# EAGLE design FD Capacitance Sensor v15 (EAGLE 9.5.2)
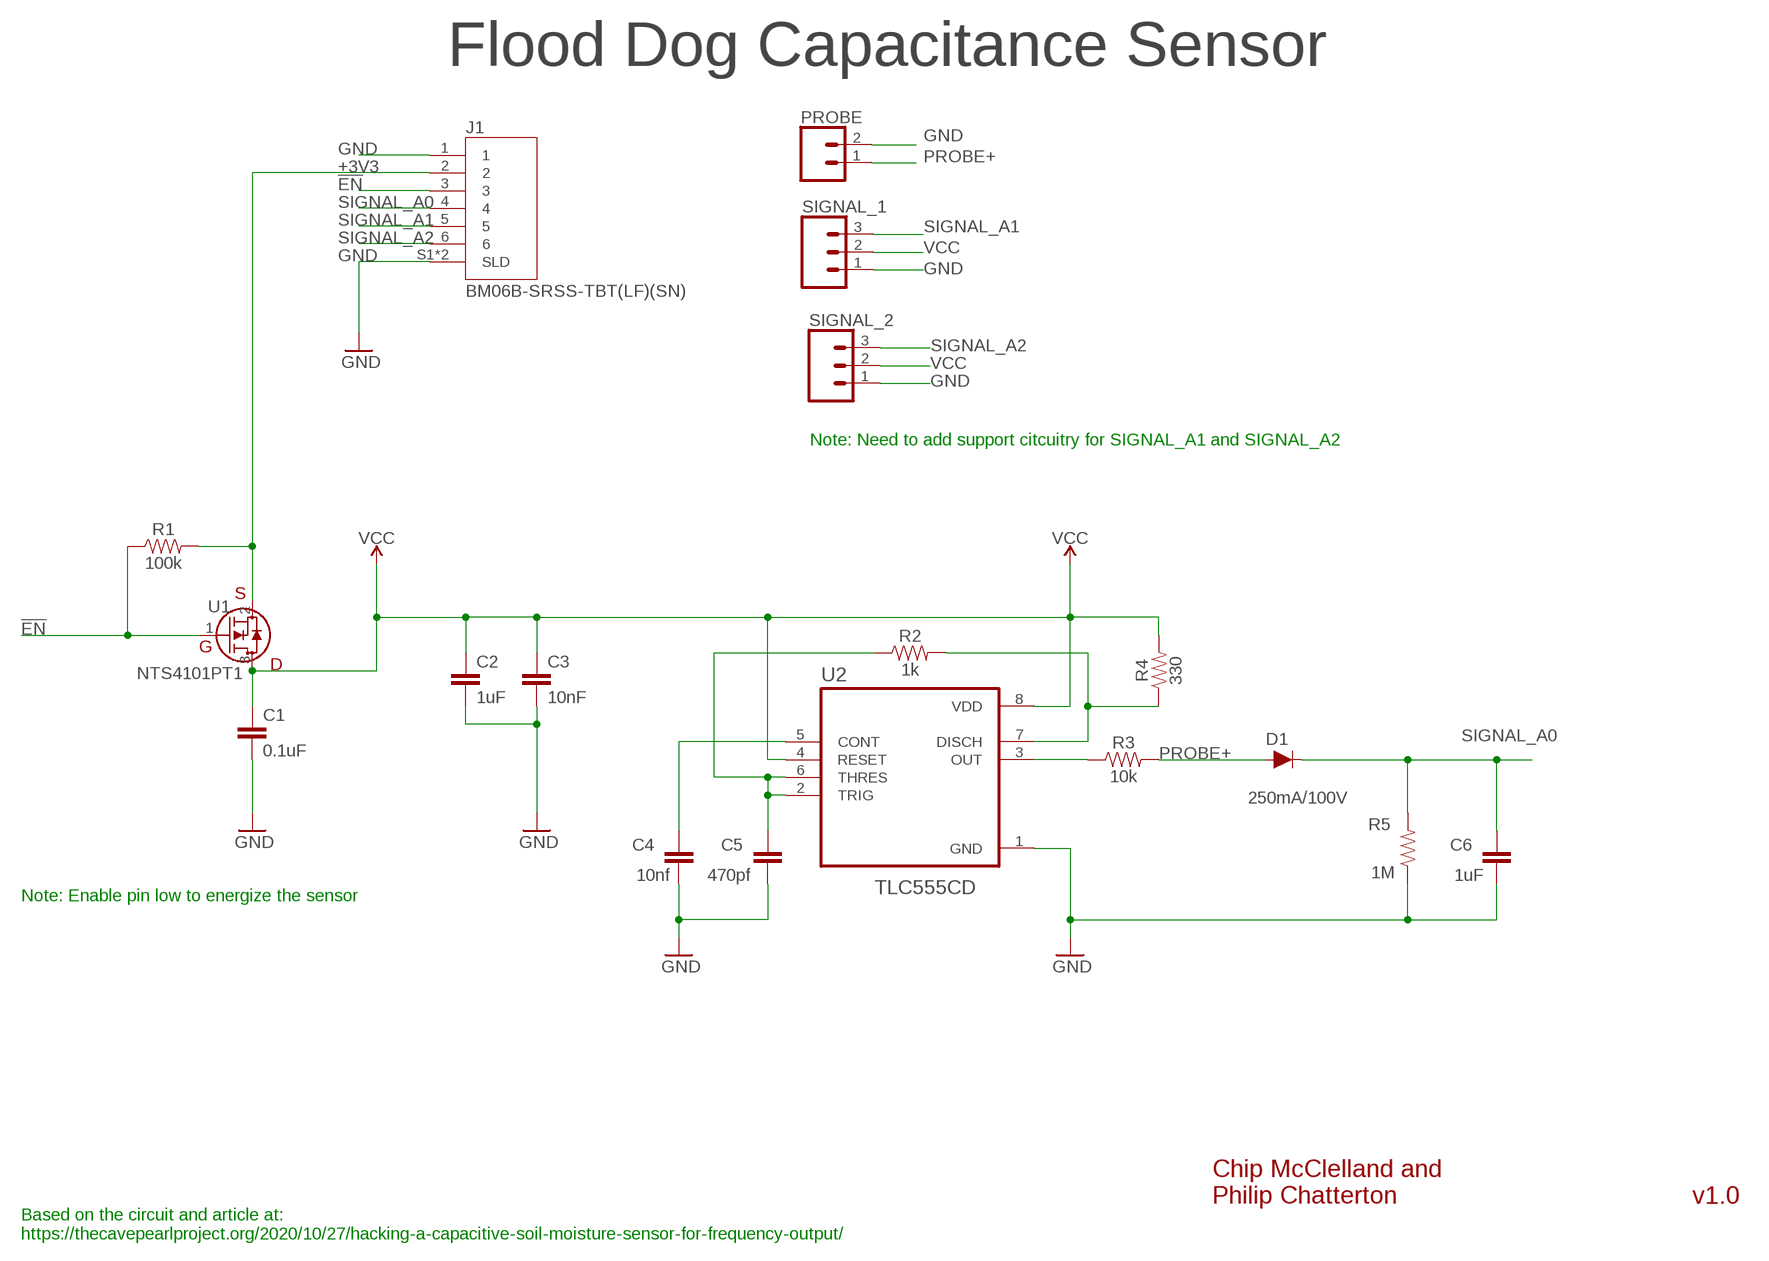
[diagram p0: schematic, sheet 1]

## Parts
C1  0.1uF  CAP-MF-0.1UF-0805  [0805@1]
C2  1uF  CAP-MF-1UF-0805  [0805@1]
C3  10nF  CAP-10NF-0805  [0805@1]
C4  10nf  C-EUC0805  [C0805]
C5  470pf  C-EUC0805  [C0805]
C6  1uF  C-EUC0805  [C0805]
D1  250mA/100V  DIODE-BAS16J  [SOD-323]
J1  BM06B-SRSS-TBT(LF)(SN)  [JST_BM06B-SRSS-TB(LF)(SN)]
PROBE  CONN_02  [1X02]
R1  100k  RESISTOR-MF-100K-0805  [0805]
R2  1k  RESISTOR-MF-1K-0805  [0805]
R3  10k  RESISTOR-MF-10K-0805  [0805]
R4  330  RESISTOR-MF-330-0805  [0805]
R5  1M  RESISTOR-MF-1K-0805  [0805]
SIGNAL_1  CONN_03  [1X03]
SIGNAL_2  CONN_03  [1X03]
U1  NTS4101PT1  [SOT_101PT1_ONS]
U2  TLC555CD  [SOIC127P599X175-8N]

## Nets
!EN: J1.3 R1.1 U1.1(G)
+3V3: J1.2 R1.2 U1.2(S)
GND: C1.2 C2.2 C3.2 C4.1 C5.1 C6.1 J1.1 J1.S1(SLD) J1.S2(SLD) PROBE.2 R5.1 SIGNAL_1.1 SIGNAL_2.1 U2.1(GND)
N$1: C4.2 U2.5(CONT)
N$5: R3.1 U2.3(OUT)
N$8: C5.2 R2.1 U2.2(TRIG) U2.6(THRES)
N$9: R2.2 R4.1 U2.7(DISCH)
PROBE+: D1.A PROBE.1 R3.2
SIGNAL_A0: C6.2 D1.C J1.4 R5.2
SIGNAL_A1: J1.5 SIGNAL_1.3
SIGNAL_A2: J1.6 SIGNAL_2.3
VCC [VCC]: C1.1 C2.1 C3.1 R4.2 SIGNAL_1.2 SIGNAL_2.2 U1.3(D) U2.4(RESET) U2.8(VDD)

## Notes on the sheet
- Flood Dog Capacitance Sensor
- Note: Need to add support citcuitry for SIGNAL_A1 and SIGNAL_A2
- Note: Enable pin low to energize the sensor
- Chip McClelland and
  Philip Chatterton
- v1.0
- Based on the circuit and article at:
  https://thecavepearlproject.org/2020/10/27/hacking-a-capacitive-soil-moisture-sensor-for-frequency-output/

## Library data of the parts
C1 = Custom Components:CAP-MF-0.1UF-: Capacitor Macrofab House Part (https://factory.macrofab.com/parts). Standard ceramic capacitor, and 0.1" leaded capacitor.; HOUSEPART: YES; MPN: MF-CAP-0805-0.1uF; POPULATE: 1; URL: https://factory.macrofab.com/part/MF-CAP-0805-0.1uF
C2 = Custom Components:CAP-MF-1UF-: Capacitor Macrofab House Part (https://factory.macrofab.com/parts). Standard ceramic capacitor, and 0.1" leaded capacitor.; HOUSEPART: yes; MPN: MF-CAP-0805-1uF; POPULATE: 1; URL: https://factory.macrofab.com/part/MF-CAP-0805-1uF
C3 = Custom Components:CAP-10NF-: Capacitor 10nF variant Standard 0805 ceramic capacitor; DIGIKEY: 399-C0805X103K1RAC3316CT-ND; HOUSEPART: NO; MPN: C0805X103K1RAC3316; POPULATE: 1; URL: https://www.digikey.com/en/products/detail/kemet/C0805X103K1RAC3316/10315780
C4-C6 = rcl:C-EU: CAPACITOR, European symbol; SPICEPREFIX: C
D1 = Custom Components:DIODE: Diode These are standard reverse protection diodes and small signal diodes. SparkFun Products: SparkFun SparkPunk Sound Kit <https://www.sparkfun.com/products/11177> SparkFun ESP8266 Thing <https://www.sparkfun.com/products/13231>; MPN: BAS16HT1G
J1 = Custom Components:BM06B-SRSS-TBT(LF)(SN): 6 Position 1.0mm Top-Entry Surface Mount Shrouded Header; MPN: BM06B-SRSS-TBT(LF)(SN); POPULATE: 1
PROBE = SparkFun-Connectors:CONN_02: Multi connection point. Often used as Generic Header-pin footprint for 0.1 inch spaced/style header connections On any of the 0.1 inch spaced packages, you can populate with these: Break Away Headers - Straight <https://www.sparkfun.com/products/116> (PRT-00116) Break Away Male Headers - Right Angle <https://www.sparkfun.com/products/553> (PRT-00553) Female Headers <https://www.sparkfun.com/products/115> (PRT-00115) Break Away Headers - Machine Pin <https://www.sparkfun.com/products/117> (PRT-00117) Break Away Female Headers - Swiss Machine Pin <https://www.sparkfun.com/products/743> (PRT-00743) For SCREWTERMINALS and SPRING TERMINALS visit here: Screw Terimnals on SparkFun.com <https://www.sparkfun.com/search/results?term=Screw+Terminals> (5mm/3.5mm/2.54mm spacing) This device is also useful as a general connection point to wire up your design to another part of your project. Our various solder wires solder well into these plated through hole pads. Hook-Up Wire - Assortment (Stranded, 22 AWG) <https://www.sparkfun.com/products/11375> (PRT-11375) Hook-Up Wire - Assortment (Solid Core, 22 AWG) <https://www.sparkfun.com/products/11367> (PRT-11367) View the entire wire category on our website here <https://www.sparkfun.com/categories/141> Special notes: Molex polarized connector foot print use with: PRT-08233 with associated crimp pins and housings. 2.54_SCREWTERM for use with PRT-10571. 3.5mm Screw Terminal footprints for PRT-08084 5mm Screw Terminal footprints for use with PRT-08432
R1 = Custom Components:RESISTOR-MF-100K-: Generic 0805 Resistor Package; MPN: MF-RES-0805-100K; POPULATE: 1; URL: https://factory.macrofab.com/part/MF-RES-0805-100K
R2 = Custom Components:RESISTOR-MF-1K-: Generic 0805 Resistor Package; HOUSEPART: YES; MPN: MF-RES-0805-1K; POPULATE: 1; URL: https://factory.macrofab.com/part/MF-RES-0805-1k
R3 = Custom Components:RESISTOR-MF-10K-: Generic 0805 Resistor Package; MPN: MF-RES-0805-10K; POPULATE: 1; URL: https://factory.macrofab.com/part/MF-RES-0805-10K
R4 = Custom Components:RESISTOR-MF-330-: Generic 0805 Resistor Package; HOUSEPART: YES; MPN: MF-RES-0805-330; POPULATE: 1
R5 = Custom Components:RESISTOR-MF-1K-: Generic 0805 Resistor Package; HOUSEPART: YES; MPN: MF-RES-0805-1K; POPULATE: 1; URL: https://factory.macrofab.com/part/MF-RES-0805-1k; VALUE: 1k
SIGNAL_1 SIGNAL_2 = SparkFun-Connectors:CONN_03: Multi connection point. Often used as Generic Header-pin footprint for 0.1 inch spaced/style header connections On any of the 0.1 inch spaced packages, you can populate with these: Break Away Headers - Straight <https://www.sparkfun.com/products/116> (PRT-00116) Break Away Male Headers - Right Angle <https://www.sparkfun.com/products/553> (PRT-00553) Female Headers <https://www.sparkfun.com/products/115> (PRT-00115) Break Away Headers - Machine Pin <https://www.sparkfun.com/products/117> (PRT-00117) Break Away Female Headers - Swiss Machine Pin <https://www.sparkfun.com/products/743> (PRT-00743) Stackable Header - 3 Pin (Female, 0.1") <https://www.sparkfun.com/products/13875> (PRT-13875) For SCREWTERMINALS and SPRING TERMINALS visit here: Screw Terimnals on SparkFun.com <https://www.sparkfun.com/search/results?term=Screw+Terminals> (5mm/3.5mm/2.54mm spacing) This device is also useful as a general connection point to wire up your design to another part of your project. Our various solder wires solder well into these plated through hole pads. Hook-Up Wire - Assortment (Stranded, 22 AWG) <https://www.sparkfun.com/products/11375> (PRT-11375) Hook-Up Wire - Assortment (Solid Core, 22 AWG) <https://www.sparkfun.com/products/11367> (PRT-11367) View the entire wire category on our website here <https://www.sparkfun.com/categories/141> Special notes: Molex polarized connector foot print use with SKU : PRT-08232 with associated crimp pins and housings.
U1 = Custom Components:NTS4101PT1; DATASHEET: https://datasheet.octopart.com/NTS4101PT1-ON-Semiconductor-datasheet-139013286.pdf; MANUFACTURER_PART_NUMBER: NTS4101PT1; SOURCELIBRARY: ON_Semiconductor_2020-03-06; VENDOR: ON Semiconductor
U2 = Custom Components:TLC555CD; DESCRIPTION: 2.1-MHz, 250-A, Low-Power Timer 8-SOIC 0 to 70; DIGI-KEY_PART_NUMBER: 296-52992-ND; MF: Texas Instruments; MP: TLC555CD; PACKAGE: SOIC-8 Texas Instruments; PURCHASE-URL: https://pricing.snapeda.com/search/part/TLC555CD/?ref=eda

## Board
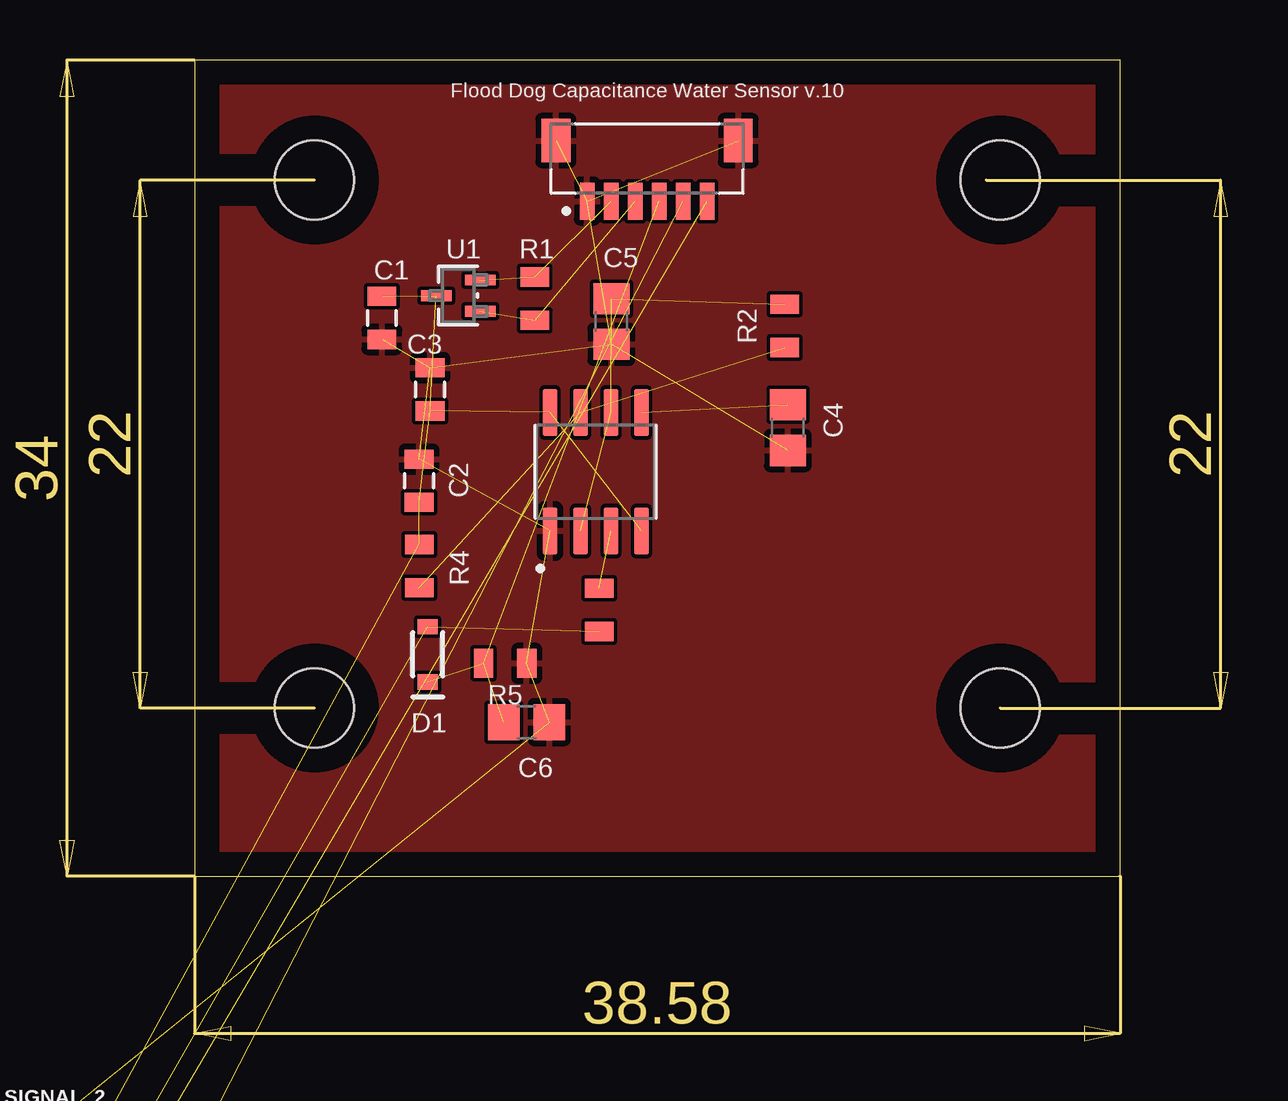
[diagram p1: board, top side]
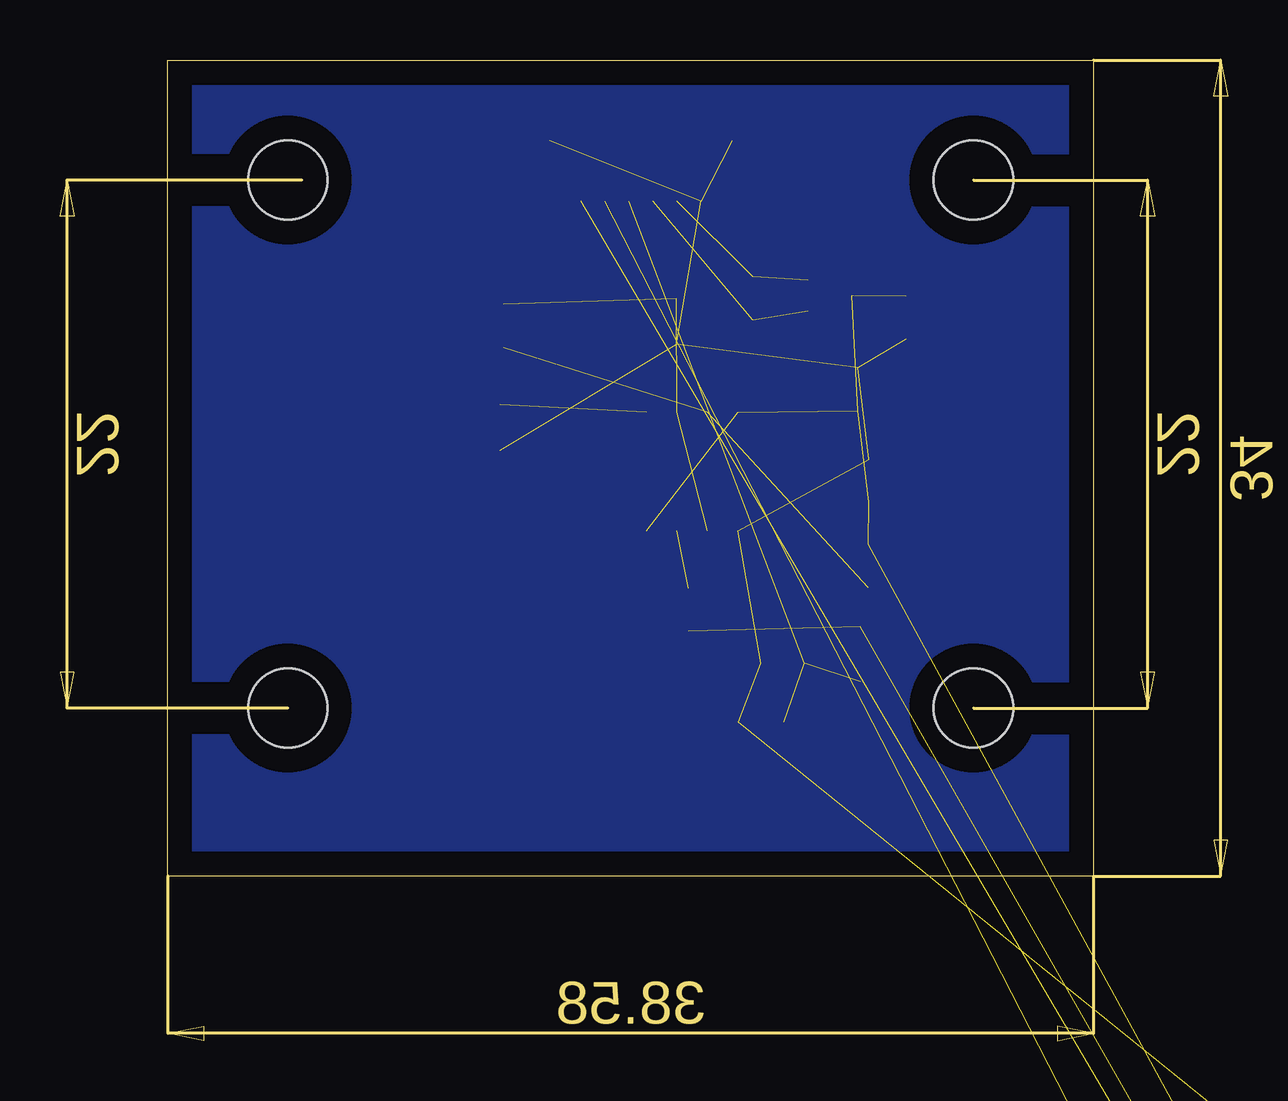
[diagram p2: board, bottom side, seen from below]

Size 38.58 x 34 mm. Coordinates in mm from the lower left corner, seen from the top.
Outline: 0,0 38.58,0 38.58,34 0,34 0,0
Copper layers (1*16): Top 0.035mm / dielectric 1.5mm / Bottom 0.035mm
Design rules "default": minimum track width 6mil, minimum drill 0.35mm, track to track 6mil, track to pad 6mil, pad to pad 6mil, via to via 6mil, smd to smd 6mil, copper to edge 40mil, drill to drill 6mil, minimum pad ring 10mil, minimum via ring 8mil, stop-mask expansion 4mil, vias tented up to drill 0mil, thermal gap 10mil

### Footprints (pad centres in the part's own frame; a part is rotated, then mirrored left to right if it is on the bottom)
0805@1 = smd 0.8 x 1.2: 1 -0.9,0; 2 0.9,0
C0805 = smd 1.3 x 1.5: 1 -0.95,0; 2 0.95,0
SOD-323 = smd 0.63 x 0.83: A 1.15,0; C -1.15,0
JST_BM06B-SRSS-TB(LF)(SN) = smd 0.6 x 1.55: 1 -2.5,-2.525; 2 -1.5,-2.525; 3 -0.5,-2.525; 4 0.5,-2.525; 5 1.5,-2.525; 6 2.5,-2.525 | smd 1.2 x 1.8: S1 -3.8,0; S2 3.8,0
1X02 = drill 1.016 pad 1.88: 1 0,0; 2 2.54,0
0805 = smd 0.8 x 1.2: 1 -0.9,0; 2 0.9,0
1X03 = drill 1.016 pad 1.88: 1 0,0; 2 2.54,0; 3 5.08,0
SOT_101PT1_ONS = smd 0.457 x 1.27: 1 -0.65,-0.914; 2 0.65,-0.914; 3 0,0.914
SOIC127P599X175-8N = smd 1.97 x 0.6: 1 -2.47,1.905; 2 -2.47,0.635; 3 -2.47,-0.635; 4 -2.47,-1.905; 5 2.47,-1.905; 6 2.47,-0.635; 7 2.47,0.635; 8 2.47,1.905
STAND-OFF = hole 3.302: 0,0

### Placement (x,y rotation side)
C1  7.81,23.26 270 top
C2  9.36,16.47 90 top
C3  9.81,20.28 90 top
C4  24.72,18.68 90 top
C5  17.37,23.1 90 top
C6  13.84,6.41 180 top
D1  9.71,9.24 90 top
J1  18.86,30.65 0 top
PROBE  -6.65,-18.26 0 top  (outside the outline)
R1  14.18,24.06 90 top
R2  24.59,22.92 270 top
R3  16.87,11.09 270 top
R4  9.37,12.91 90 top
R5  12.95,8.86 180 top
SIGNAL_1  -6.65,-14.58 0 top  (outside the outline)
SIGNAL_2  -6.65,-10.9 0 top  (outside the outline)
U1  10.99,24.18 90 top
U2  16.72,16.85 90 top
U$1  STAND-OFF  [STAND-OFF]  5,7 0 top
U$2  STAND-OFF  [STAND-OFF]  5,29 0 top
U$3  STAND-OFF  [STAND-OFF]  33.58,29 0 top
U$4  STAND-OFF  [STAND-OFF]  33.58,7 0 top

### Tracks (layer width: path | path; a pad name or v marks a point on that pad's centre or on a via)
!EN  (2 unrouted)
+3V3  (2 unrouted)
GND  (13 unrouted)
  pour Top: -0.81,-0.55 -0.81,34.76 39.52,34.76 39.52,-0.55
  pour Bottom: -0.58,-0.35 -0.58,34.5 39.19,34.5 39.19,-0.35
N$1  (1 unrouted)
N$5  (1 unrouted)
N$8  (3 unrouted)
N$9  (2 unrouted)
PROBE+  (2 unrouted)
SIGNAL_A0  (3 unrouted)
SIGNAL_A1  (1 unrouted)
SIGNAL_A2  (1 unrouted)
VCC  (8 unrouted)

### Text on the board
tNames: Flood Dog Capacitance Water Sensor v.10